# Altium schematic sheet Power_Communications_MCU.SchDoc: MCU, Power, Communications
size B; Date: [Date]; SheetNumber: 1; SheetTotal: 5
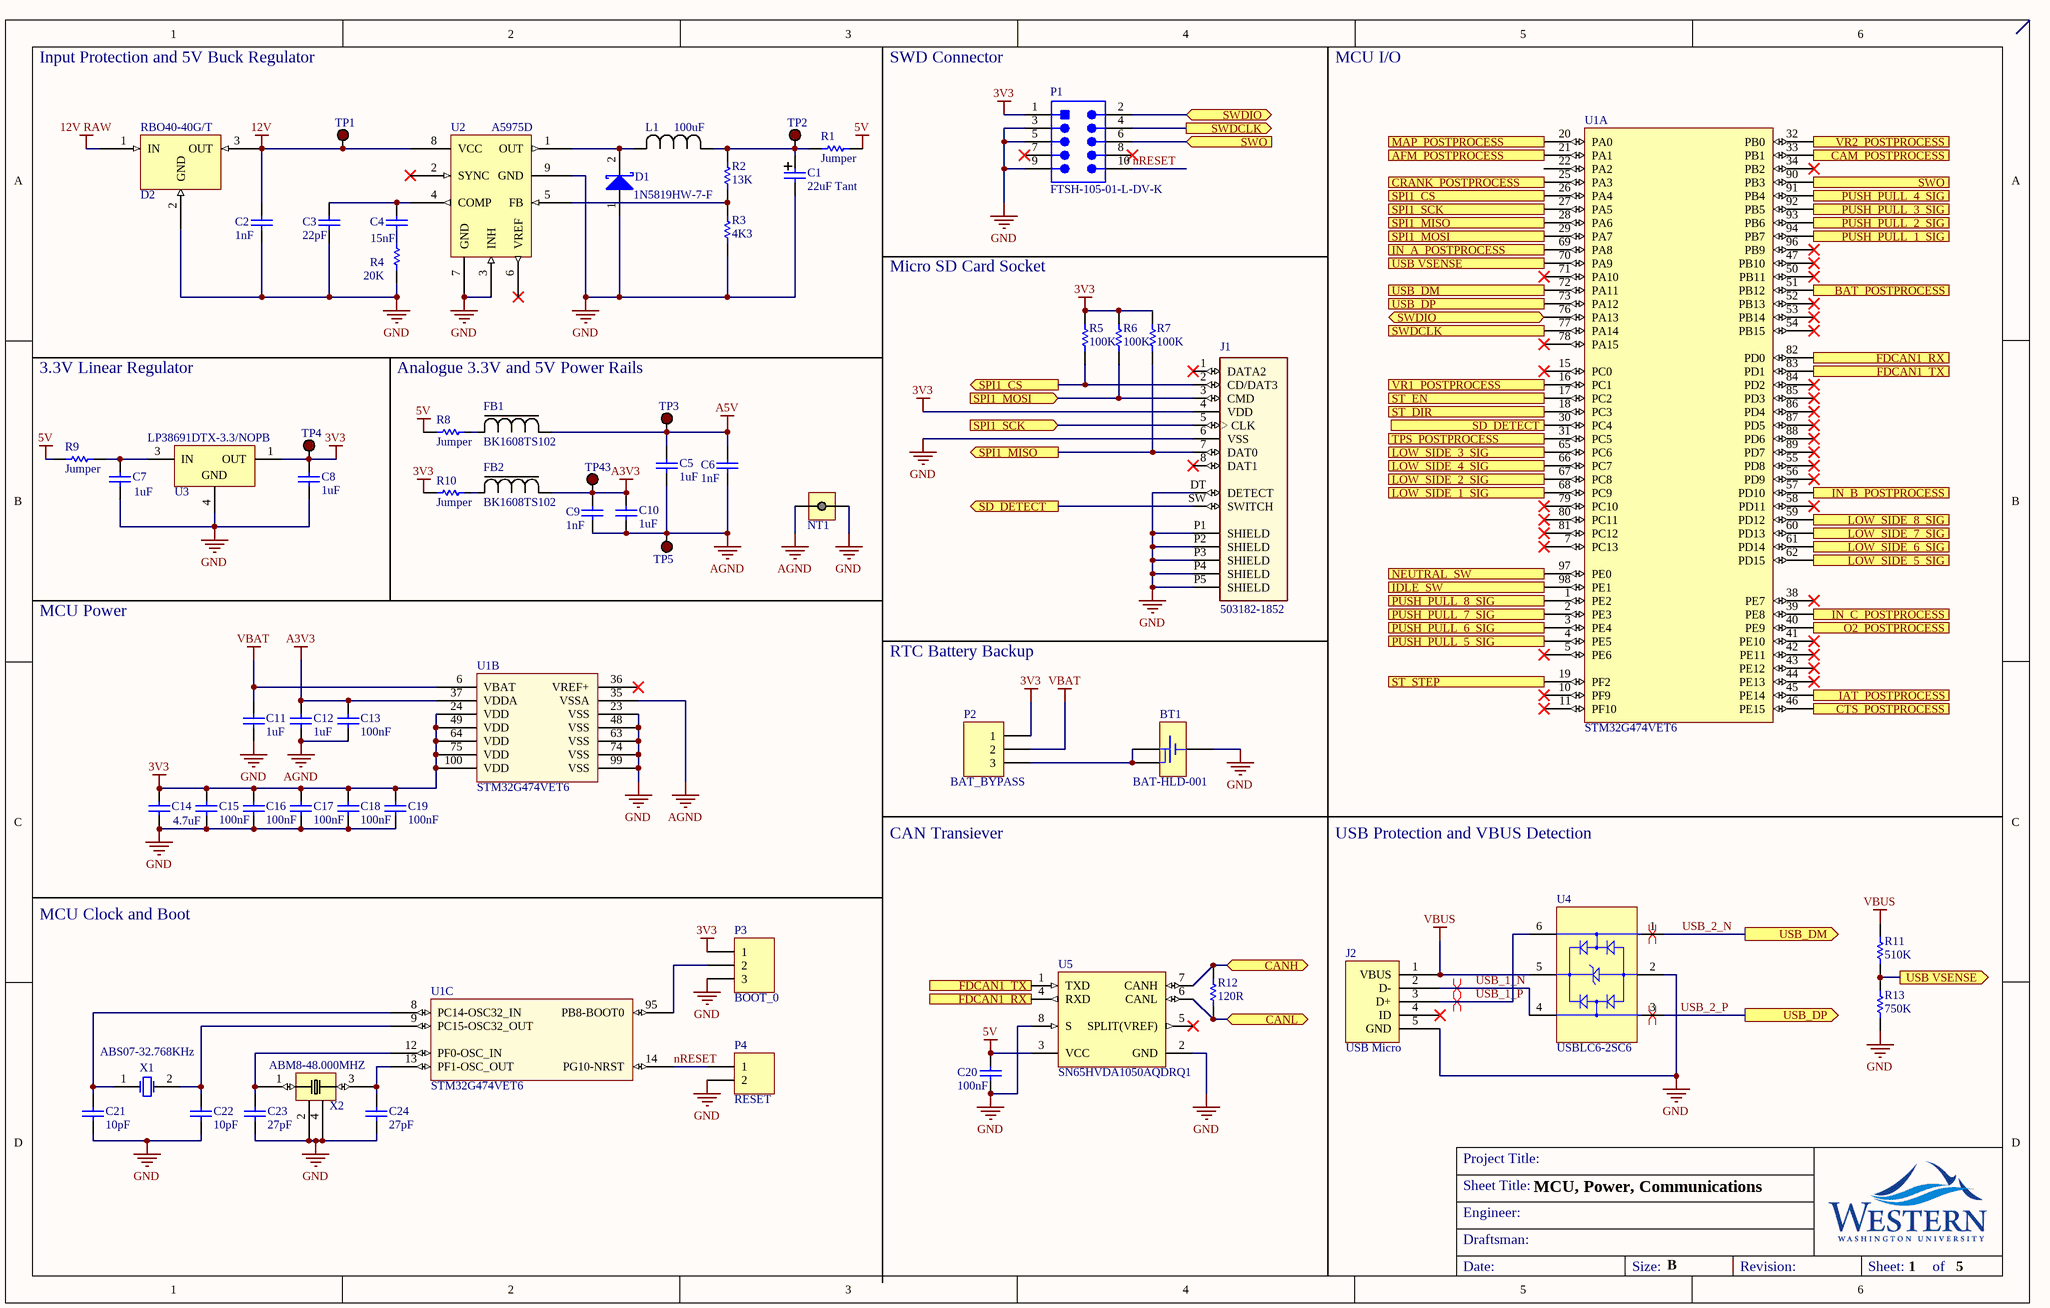
[diagram p0: Power_Communications_MCU.SchDoc]

## Parts
BT1  BAT-HLD-001  [BATHLD-001]
C1  22uF Tant  [CAPC1210(3225)280_L]
C2  1nF  [CAPC0603(1608)100_N]
C3  22pF  [CAPC0603(1608)100_M]
C4  15nF  [CAPC0603(1608)100_M]
C5  1uF  [CAPC0603(1608)100_M]
C6  1nF  [CAPC0603(1608)100_M]
C7  1uF  [CAPC0603(1608)100_M]
C8  1uF  [CAPC0603(1608)100_M]
C9  1nF  [CAPC0603(1608)100_M]
C10  1uF  [CAPC0603(1608)100_M]
C11  1uF  [CAPC0603(1608)100_L]
C12  1uF  [CAPC0603(1608)100_L]
C13  100nF  [CAPC0603(1608)100_L]
C14  4.7uF  [CAPC0603(1608)55_L]
C15  100nF  [CAPC0603(1608)100_L]
C16  100nF  [CAPC0603(1608)100_L]
C17  100nF  [CAPC0603(1608)100_L]
C18  100nF  [CAPC0603(1608)100_L]
C19  100nF  [CAPC0603(1608)100_L]
C20  100nF  [CAPC0603(1608)100_M]
C21  10pF  [CAPC0603(1608)100_L]
C22  10pF  [CAPC0603(1608)100_L]
C23  27pF  [CAPC0603(1608)100_M]
C24  27pF  [CAPC0603(1608)100_M]
D1  1N5819HW-7-F  [DIOD-SOD-123-2_V]
D2  RBO40-40G/T  [D2PAK-L]
FB1  BK1608TS102  [BK1608TS102-T]
FB2  BK1608TS102  [BK1608TS102-T]
J1  503182-1852  [*MOLEX_503182-1852_503182-1852(Primary)]
J2  USB Micro  [USB_CONN]
L1  100uF  [IND_BOURNS_SRR1260-101M]
NT1  NET TIE 0603  [NetTie0603]  (value not drawn)  (net tie, no BOM)
P1  FTSH-105-01-L-DV-K  [SMTC-FTSH-105-01-L-DV-K_V]
P2  BAT_BYPASS  [HDR1X3]
P3  BOOT_0  [HDR1X3]
P4  RESET  [HDR1X2]
R1  Jumper  [RESC0603(1608)_N]
R2  13K  [RESC0603(1608)_M]
R3  4K3  [RESC0603(1608)_M]
R4  20K  [RESC0603(1608)_M]
R5  100K  [RESC0603(1608)_N]
R6  100K  [RESC0603(1608)_N]
R7  100K  [RESC0603(1608)_N]
R8  Jumper  [RESC0603(1608)_N]
R9  Jumper  [RESC0603(1608)_M]
R10  Jumper  [RESC0603(1608)_N]
R11  510K  [RESC0603(1608)_M]
R12  120R  [RESC0603(1608)_L]
R13  750K  [RESC0603(1608)_M]
TP1  5001  [Keystone_5001]  (value not drawn)
TP2  5001  [Keystone_5001]  (value not drawn)
TP3  5001  [Keystone_5001]  (value not drawn)
TP4  5001  [Keystone_5001]  (value not drawn)
TP5  5001  [Keystone_5001]  (value not drawn)
TP43  5001  [Keystone_5001]  (value not drawn)
U1  STM32G474VET6  [STM32G474VET6]  (parts A,B,C of 3)
U2  A5975D  [A5975D_Medium_Density]
U3  LP38691DTX-3.3/NOPB  [TD03B_M]
U4  USBLC6-2SC6  [USBLC6-2SC6]
U5  SN65HVDA1050AQDRQ1  [D8_L]
X1  ABS07-32.768KHz  [ABRA-ABS07-2_V]
X2  ABM8-48.000MHZ  [ABM8-48.000MHZ-10-1-U-T]

## Ports
AFM_POSTPROCESS (in), BAT_POSTPROCESS (in), CAM_POSTPROCESS (in), CANH (bidir), CANL (bidir), CRANK_POSTPROCESS (in), CTS_POSTPROCESS (in), FDCAN1_RX (in), FDCAN1_RX (out), FDCAN1_TX (in), FDCAN1_TX (out), IAT_POSTPROCESS (in), IDLE_SW (out), IN_A_POSTPROCESS (in), IN_B_POSTPROCESS (in), IN_C_POSTPROCESS (in), LOW_SIDE_1_SIG (out), LOW_SIDE_2_SIG (out), LOW_SIDE_3_SIG (out), LOW_SIDE_4_SIG (out), LOW_SIDE_5_SIG (out), LOW_SIDE_6_SIG (out), LOW_SIDE_7_SIG (out), LOW_SIDE_8_SIG (out), MAP_POSTPROCESS (in), NEUTRAL_SW (out), O2_POSTPROCESS (in), PUSH_PULL_1_SIG (out), PUSH_PULL_2_SIG (out), PUSH_PULL_3_SIG (out), PUSH_PULL_4_SIG (out), PUSH_PULL_5_SIG (out), PUSH_PULL_6_SIG (out), PUSH_PULL_7_SIG (out), PUSH_PULL_8_SIG (out), SD_DETECT (in), SD_DETECT (out), SPI1_CS (out), SPI1_MISO (in), SPI1_MISO (out), SPI1_MOSI (in), SPI1_MOSI (out), SPI1_SCK (in), SPI1_SCK (out), ST_DIR (out), ST_EN (out), ST_STEP (out), SWDCLK (in), SWDCLK (out), SWDIO (bidir), SWO (in), SWO (out), TPS_POSTPROCESS (in), USB VSENSE (in), USB VSENSE (out), USB_DM (out), USB_DP (out), VR1_POSTPROCESS (in), VR2_POSTPROCESS (in)

## Nets
3V3: C8.2 C14.2 C15.2 C16.2 C17.2 C18.2 C19.2 J1.4(VDD) P1.1 P2.1 P3.1 R5.2 R6.2 R7.2 R10.1 TP4.1(TP) U1.24(VDD) U1.49(VDD) U1.64(VDD) U1.75(VDD) U1.100(VDD) U3.1(OUT)
5V: C20.2 R1.2 R8.1 R9.1 U5.3(VCC)
12V: C2.1 D2.3(OUT) TP1.1(TP) U2.8(VCC)
12V RAW: D2.1(IN)
A3V3: C9.1 C10.2 C12.2 C13.2 FB2.1 TP43.1(TP) U1.37(VDDA)
A5V: C5.2 C6.1 FB1.1 TP3.1(TP)
AGND: C5.1 C6.2 C9.2 C10.1 C12.1 C13.1 NT1.1 TP5.1(TP) U1.35(VSSA)
GND: BT1.1(-) C1.1 C2.2 C3.1 C7.1 C8.1 C11.1 C14.1 C15.1 C16.1 C17.1 C18.1 C19.1 C20.1 C21.1 C22.1 C23.1 C24.1 D1.1(A) D2.2(GND) J1.6(VSS) J1.DT(DETECT) J1.P1(SHIELD) J1.P2(SHIELD) J1.P3(SHIELD) J1.P4(SHIELD) J1.P5(SHIELD) J2.5(GND) NT1.2 P1.3 P1.5 P1.9 P3.3 P4.2 R3.2 R4.1 R13.1 U1.23(VSS) U1.48(VSS) U1.63(VSS) U1.74(VSS) U1.99(VSS) U2.3(INH) U2.7(GND) U2.9(GND) U3.4(GND) U4.2(GND) U5.2(GND) U5.8(S) X2.2 X2.4
VBAT: C11.2 P2.2 U1.6(VBAT)
VBUS: J2.1(VBUS) R11.2 U4.5(VBUS)
AFM_POSTPROCESS: U1.21(PA1) ; port AFM_POSTPROCESS
BAT_POSTPROCESS: U1.51(PB12) ; port BAT_POSTPROCESS
CAM_POSTPROCESS: U1.33(PB1) ; port CAM_POSTPROCESS
CANH: R12.2 U5.7(CANH) ; port CANH
CANL: R12.1 U5.6(CANL) ; port CANL
CRANK_POSTPROCESS: U1.25(PA3) ; port CRANK_POSTPROCESS
CTS_POSTPROCESS: U1.46(PE15) ; port CTS_POSTPROCESS
FDCAN1_RX: U1.82(PD0) U5.4(RXD) ; port FDCAN1_RX
FDCAN1_TX: U1.83(PD1) U5.1(TXD) ; port FDCAN1_TX
IAT_POSTPROCESS: U1.45(PE14) ; port IAT_POSTPROCESS
IDLE_SW: U1.98(PE1) ; port IDLE_SW
IN_A_POSTPROCESS: U1.69(PA8) ; port IN_A_POSTPROCESS
IN_B_POSTPROCESS: U1.57(PD10) ; port IN_B_POSTPROCESS
IN_C_POSTPROCESS: U1.39(PE8) ; port IN_C_POSTPROCESS
LOW_SIDE_1_SIG: U1.68(PC9) ; port LOW_SIDE_1_SIG
LOW_SIDE_2_SIG: U1.67(PC8) ; port LOW_SIDE_2_SIG
LOW_SIDE_3_SIG: U1.65(PC6) ; port LOW_SIDE_3_SIG
LOW_SIDE_4_SIG: U1.66(PC7) ; port LOW_SIDE_4_SIG
LOW_SIDE_5_SIG: U1.62(PD15) ; port LOW_SIDE_5_SIG
LOW_SIDE_6_SIG: U1.61(PD14) ; port LOW_SIDE_6_SIG
LOW_SIDE_7_SIG: U1.60(PD13) ; port LOW_SIDE_7_SIG
LOW_SIDE_8_SIG: U1.59(PD12) ; port LOW_SIDE_8_SIG
MAP_POSTPROCESS: U1.20(PA0) ; port MAP_POSTPROCESS
NEUTRAL_SW: U1.97(PE0) ; port NEUTRAL_SW
nRESET: P1.10 P4.1 U1.14(PG10-NRST)
O2_POSTPROCESS: U1.40(PE9) ; port O2_POSTPROCESS
PUSH_PULL_1_SIG: U1.94(PB7) ; port PUSH_PULL_1_SIG
PUSH_PULL_2_SIG: U1.93(PB6) ; port PUSH_PULL_2_SIG
PUSH_PULL_3_SIG: U1.92(PB5) ; port PUSH_PULL_3_SIG
PUSH_PULL_4_SIG: U1.91(PB4) ; port PUSH_PULL_4_SIG
PUSH_PULL_5_SIG: U1.4(PE5) ; port PUSH_PULL_5_SIG
PUSH_PULL_6_SIG: U1.3(PE4) ; port PUSH_PULL_6_SIG
PUSH_PULL_7_SIG: U1.2(PE3) ; port PUSH_PULL_7_SIG
PUSH_PULL_8_SIG: U1.1(PE2) ; port PUSH_PULL_8_SIG
SD_DETECT: J1.SW(SWITCH) U1.30(PC4) ; port SD_DETECT
SPI1_CS: J1.2(CD/DAT3) R5.1 U1.26(PA4) ; port SPI1_CS
SPI1_MISO: J1.7(DAT0) R7.1 U1.28(PA6) ; port SPI1_MISO
SPI1_MOSI: J1.3(CMD) R6.1 U1.29(PA7) ; port SPI1_MOSI
SPI1_SCK: J1.5(CLK) U1.27(PA5) ; port SPI1_SCK
ST_DIR: U1.18(PC3) ; port ST_DIR
ST_EN: U1.17(PC2) ; port ST_EN
ST_STEP: U1.19(PF2) ; port ST_STEP
SWDCLK: P1.4 U1.77(PA14) ; port SWDCLK
SWDIO: P1.2 U1.76(PA13) ; port SWDIO
SWO: P1.6 U1.90(PB3) ; port SWO
TPS_POSTPROCESS: U1.31(PC5) ; port TPS_POSTPROCESS
USB VSENSE: R11.1 R13.2 U1.70(PA9) ; port USB VSENSE
USB_1_N: J2.2(D-) U4.4(I/O_3)
USB_1_P: J2.3(D+) U4.6(I/O_4)
USB_2_N: U1.72(PA11) U4.1(I/O_1) ; port USB_DM
USB_2_P: U1.73(PA12) U4.3(I/O_2) ; port USB_DP
VR1_POSTPROCESS: U1.16(PC1) ; port VR1_POSTPROCESS
VR2_POSTPROCESS: U1.32(PB0) ; port VR2_POSTPROCESS
NetBT1_2: BT1.2(+) BT1.3(+) P2.3
NetC1_2: C1.2 L1.1 R1.1 R2.2 TP2.1(TP)
NetC3_2: C3.2 C4.2 U2.4(COMP)
NetC4_1: C4.1 R4.2
NetC7_2: C7.2 R9.2 U3.3(IN)
NetC21_2: C21.2 U1.8(PC14-OSC32_IN) X1.1(X1)
NetC22_2: C22.2 U1.9(PC15-OSC32_OUT) X1.2(X2)
NetC23_2: C23.2 U1.12(PF0-OSC_IN) X2.1
NetC24_2: C24.2 U1.13(PF1-OSC_OUT) X2.3
NetD1_2: D1.2(K) L1.2 U2.1(OUT)
NetFB1_2: FB1.2 R8.2
NetFB2_2: FB2.2 R10.2
NetP3_2: P3.2 U1.95(PB8-BOOT0)
NetR2_1: R2.1 R3.1 U2.5(FB)

Not connected (* = marked no-connect by the designer): J1 1(DATA2)* 8(DAT1)*; J2 4(ID)*; P1 7* 8*; U1 5(PE6)* 7(PC13)* 10(PF9)* 11(PF10)* 15(PC0)* 22(PA2) 34(PB2)* 36(VREF+)* 38(PE7)* 41(PE10)* 42(PE11)* 43(PE12)* 44(PE13)* 47(PB10)* 50(PB11)* 52(PB13)* 53(PB14)* 54(PB15)* 55(PD8)* 56(PD9)* 58(PD11)* 71(PA10)* 78(PA15)* 79(PC10)* 80(PC11)* 81(PC12)* 84(PD2)* 85(PD3)* 86(PD4)* 87(PD5)* 88(PD6)* 89(PD7)* 96(PB9)*; U2 2(SYNC)* 6(VREF)*; U5 5(SPLIT(VREF))*

## Layout directives
differential pair: USB_1_N, USB_1_P, USB_2_N, USB_2_P

## Notes on the sheet
- Input Protection and 5V Buck Regulator
- SWD Connector
- MCU I/O
- Micro SD Card Socket
- 3.3V Linear Regulator
- Analogue 3.3V and 5V Power Rails
- MCU Power
- RTC Battery Backup
- CAN Transiever
- USB Protection and VBUS Detection
- MCU Clock and Boot
- Sheet Title:
- Project Title:
- Engineer:
- Draftsman:
- Date:
- Size:
- B
- Revision:
- Sheet:        of

## Library data of the parts
BT1 = CMP-0168-00043-1: 20mm Coin Cell Battery Holder; PCB_Layout: Complies with manufacturer's recommendation.; DatasheetVersion: rev1.0, Dec-2007; PackageVersion: rev1.0, Dec-2007; PackageReference: BATHLD-001; PackageDescription: Low Profile SM Battery Holder, 20mm Lithium Cell, 21.1 x 15.3 x 4.2 mm Body
C1 = CMP-1038-02268-1: 22uF 10V 1210 (3225 Metric) SMD; Case-Metric: 3225; Case-EIA: 1210; Tolerance: Â±10%; Max Thickness: 2.8 mm; Value: 22uF; Technology: SMT; Rated Voltage: 10 V
C2 = CMP-1035-01887-1: 1nF 50V 0603 (1608 Metric); Case-EIA: 0603; Case-Metric: 1608; Tolerance: Â±2%; Max Thickness: 1 mm; Rated Voltage: 50 V; Value: 1nF; Technology: SMT
C3 = CMP-1035-00822-1: 22pF 50V 0603 (1608 Metric); Case-Metric: 1608; Tolerance: Â±10%; Case-EIA: 0603; Technology: SMT; Max Thickness: 1 mm; Rated Voltage: 50 V; Value: 22pF
C4 = CMP-1035-02380-1: 15nF 50V 0603 (1608 Metric); Case-Metric: 1608; Case-EIA: 0603; Tolerance: Â±5%; Technology: SMT; Max Thickness: 1 mm; Value: 15nF; Rated Voltage: 50 V
C5 C10-C12 = CMP-1035-02733-1: CAP 1uF 10V ±10% 0603 (1608 Metric) Thickness 1mm SMD; Tolerance: Â±10%; Case-EIA: 0603; Case-Metric: 1608; Rated Voltage: 10 V; Max Thickness: 1 mm; Value: 1uF; Technology: SMT
C6 C9 = CMP-1035-01887-1: CAP 1nF 50V ±2% 0603 (1608 Metric) Thickness 1mm SMD; Case-EIA: 0603; Case-Metric: 1608; Tolerance: Â±2%; Max Thickness: 1 mm; Rated Voltage: 50 V; Value: 1nF; Technology: SMT
C7 C8 = CMP-1035-02745-1: CAP 1uF 50V ±10% 0603 (1608 Metric) Thickness 1mm SMD; Case-EIA: 0603; Case-Metric: 1608; Tolerance: Â±10%; Technology: SMT; Value: 1uF; Rated Voltage: 50 V; Max Thickness: 1 mm
C13 C15-C20 = CMP-1035-02580-1: CAP 100nF 10V ±10% 0603 (1608 Metric) Thickness 1mm SMD; Tolerance: Â±10%; Case-EIA: 0603; Case-Metric: 1608; Max Thickness: 1 mm; Value: 100nF; Rated Voltage: 10 V; Technology: SMT
C14 = CMP-1035-02784-1: CAP 4.7uF 10V ±10% 0603 (1608 Metric) Thickness 0.55mm SMD; Case-Metric: 1608; Tolerance: Â±10%; Case-EIA: 0603; Technology: SMT; Max Thickness: 0.55 mm; Value: 4.7uF; Rated Voltage: 10 V
C21 C22 = CMP-1035-00556-1: CAP 10pF 50V ±1% 0603 (1608 Metric) Thickness 1mm SMD; Case-Metric: 1608; Case-EIA: 0603; Tolerance: Â±1%; Technology: SMT; Max Thickness: 1 mm; Rated Voltage: 50 V; Value: 10pF
C23 C24 = CMP-1035-00886-1: CAP 27pF 50V ±1% 0603 (1608 Metric) Thickness 1mm SMD; Case-Metric: 1608; Case-EIA: 0603; Tolerance: Â±1%; Technology: SMT; Max Thickness: 1 mm; Value: 27pF; Rated Voltage: 50 V
D1 = CMP-0303-00003-1: 1.0 A Surface Mount Schottky Barrier Rectifier; Manufacturer: Diodes Inc; @ VR (V): 40; @ Terminal Temperature TT (degC): 90; Maximum Average Rectified Current IO (A): 1; Total Capacitance CT (pF): 50; Peak Forward Surge Current IFSM (A): 25; Forward Voltage Drop VF (V): 0.45; Packing: Tape and Reel; VR (RMS) (V): 28; RoHS: TRUE; PartNumber: 1N5819HW-7-F; ComponentLink2URL: http://www.diodes.com/datasheets/ds30217.pdf; PackageDescription: 2-Pin SOD-123, Body 2.7 x 1.55 mm, Pitch 3.7 mm; @ IF (A): 1; Operating and Storage Temperature Range: -65 to 125 degC; ComponentLink1Description: Manufacturer URL; ComponentLink2Description: Datasheet; ComponentLink1URL: http://www.diodes.com/; Mounting Technology: Surface Mount; DatasheetVersion: Rev. 15-2; PackageReference: SOD-123-2; Maximum Reverse Current IR (uA): 50; Peak Repetitive Reverse Voltage VRRM (V): 40
D2 = RBO40-40G/T: Designed to protect against battery reversal andload dump overvoltages in automotive applica-tions, this monolithic component offers multiplefunctions in the same package.
J1 = 503182-1852: 10 _8 + 2_ Position Card Connector microSDâ„¢ Surface Mount, Right Angle Gold; MF: Molex; MP: 5031821852; Digi-Key_Part_Number: WM12834CT-ND; Digi-Key_Purchase_URL: https://www.digikey.com/product-detail/en/molex/5031821852/WM12834CT-ND/5823232?utm_source=snapeda&utm_medium=aggregator&utm_campaign=symbol; Package: None; SnapEDA_Link: https://www.snapeda.com/parts/5031821852/Molex/view-part/46835/?ref=snap; Value: *
J2 = USB MICRO CONN SMT R/A (Amphenol): Micro USB R/A SMT CONNECTOR; Supplier 1: Digi-Key; Supplier Part Number 1: 609-4618-1-ND
L1 = SRR1260-101M: SRR1260-101M - 100uH; Vendor: Bourns Electronics; Built_By: EMA_UL_Team; Type: DEV; Manufacturer_Part_Number: SRR1260-101M; Copyright: Copyright (C) 2018 Accelerated Designs. All rights reserved; RefDes: RefDes; Value: Value
NT1 = NET TIE
P1 = CMP-2000-05353-1: Male Header, Pitch 1.27 mm, 2 x 5 Position, Height 6.25 mm; Manufacturer: Samtec; Pitch: 0.050"(1.27mm); Other Names: Q3937619; Number of Positions: 10; Mating Products: SFMC-105-L2-S-D-TR-ND / -CONN.05"SURFACE10POSSMT / FLE-105-01-G-DV-TR-ND / -CONNSKT1.27MM10POSDUALSMD / FLE-105-01-G-DV-A-P-ND / -CONNSKT1.27MM10POSDUALSMD / FLE-105-01-G-DV-A-ND / -CONNSKT1.27MM10POSDUALSMD / CLP-105-02-G-D-P-TR-ND / -CONNRCPT10POSDUAL.05"SMD / SAM1155-05-ND / -CONNRCPT10POSDUAL.05"SMD / SAM1154-05-ND / -CONNRCPT10POSDUAL.05"SMD / SAM1153-05-ND / -CONNRCPT10POSDUAL.05"SMD / SAM1226-05-ND / -CONNRCPT.05"10POSDUALSMD; Number of Positions Loaded: All; Connector Type: Header,Unshrouded; Product Training Modules: Board-to-BoardConnectors; Datasheet Version: Rev. ET, 10/1995; Number of Rows: 2; Standard Package: 1; Package Description: Male Header, Pitch 1.27 mm, 2 x 5 Position, Height 5.97 mm, Tail Length 4.32 mm; Contact Finish Thickness: 10µin(0.25µm); Series: FTSH; Termination: Solder; Contact Type: MalePin; Color: Black; Package Reference: FTSH-105-01-L-DV-K; Family: RectangularConnectors-Headers,MalePins; Package URL: http://suddendocs.samtec.com/prints/ftsh-1xx-xx-xxx-dv-xxx-footprint.pdf; Packaging: Tube; Mounting Type: SurfaceMount; Category: Connectors,Interconnects; Datasheet URL: http://suddendocs.samtec.com/prints/ftsh-1xx-xx-xxx-dv-xxx-mkt.pdf; Row Spacing: 0.050"(1.27mm); Manufacturer URL: http://www.samtec.com/; Contact Mating Length: 0.120"(3.05mm); Contact Finish: Gold
P2 P3 = Header 3: Header, 3-Pin; LatestRevisionDate: 17-Jul-2002; LatestRevisionNote: Re-released for DXP Platform.; Publisher: Altium Limited
P4 = Header 2: Header, 2-Pin; LatestRevisionDate: 17-Jul-2002; LatestRevisionNote: Re-released for DXP Platform.; Publisher: Altium Limited
R1 R8-R10 = CMP-1012-00001-1: Jumper 0603 (1608 Metric); Case-Metric: 1608; Value: 0.00 Ohm; Power: None; Case-EIA: 0603; Technology: SMT; Tolerance: None
R2 = CMP-1012-00635-1: 13K 0.1W 1% 0603 (1608 Metric)  SMD; Case-EIA: 0603; Value: 13000.00 Ohm; Case-Metric: 1608; Tolerance: 1 %; Technology: SMT; Power: 0.1 W
R3 = CMP-1012-00581-1: 4K3 0.1W 1% 0603 (1608 Metric)  SMD; Case-Metric: 1608; Value: 4300.00 Ohm; Case-EIA: 0603; Power: 0.1 W; Tolerance: 1 %; Technology: SMT
R4 = CMP-1012-00655-1: 20K 0.1W 1% 0603 (1608 Metric)  SMD; Case-Metric: 1608; Case-EIA: 0603; Value: 20000.00 Ohm; Technology: SMT; Tolerance: 1 %; Power: 0.1 W
R5-R7 = CMP-1012-00736-1: 100K 0.1W 1% 0603 (1608 Metric)  SMD; Value: 100000.00 Ohm; Case-Metric: 1608; Case-EIA: 0603; Power: 0.1 W; Tolerance: 1 %; Technology: SMT
R11 = CMP-1012-00816-1: 510K 0.1W 1% 0603 (1608 Metric)  SMD; Value: 510000.00 Ohm; Case-EIA: 0603; Case-Metric: 1608; Tolerance: 1 %; Technology: SMT; Power: 0.1 W
R12 = CMP-1012-00052-1: 120R 0.1W 5% 0603 (1608 Metric)  SMD; Case-EIA: 0603; Value: 120.00 Ohm; Case-Metric: 1608; Technology: SMT; Power: 0.1 W; Tolerance: 5 %
R13 = CMP-1012-00835-1: 750K 0.1W 1% 0603 (1608 Metric)  SMD; Case-Metric: 1608; Case-EIA: 0603; Value: 750000.00 Ohm; Tolerance: 1 %; Technology: SMT; Power: 0.1 W
TP1-TP5 TP43 = TEST POINT: TEST POINT PC MINI .040"D BLACK; Manufacturer: Keystone Electronics; Supplier 1: Digi-Key; Manufacturer Part Number: 5001; RoHS: RoHS Compliant; Category: Test and Measurement; Stock 1: 7538; Pricing 1: 1=0.34, 10=0.315, 50=0.2296, 100=0.2206, 250=0.19812, 500=0.1891, 1000=0.15759, 2500=0.14408, 5000=0.13508 (USD); Packaging: Bulk; Type: PC Test Point, Miniature; Terminal: 0.010" x 0.020" (0.25mm x 0.51mm) Phosphor Bronze Wire, Silver Plated; Mounting Type: 0.040" (1.02mm) Hole Diameter; Material: Base, Nylon 46, UL 94V-0; Color: Black; ComponentLink1URL: http://www.keyelco.com/product-pdf.cfm?p=1310; ComponentLink1Description: http://www.keyelco.com/product-pdf.cfm?p=1310; Supplier Part Number 1: 5001K-ND
U1 = STM32G474VET6_1
U2 = A5975D: The A5975D is a step-down monolithic power / switching regulator with a minimum switch current / limit of 3.75 A, it is therefore able to deliver up to 3 / A DC current to the load depending on the / application conditions. The output voltage can be / set from 1.235 V to 35 V. The high current level is / also achieved thanks to a HSOP8 package with / exposed frame, that allows to reduce the RTHJ-A / down to approximately 40 °C/W. The device uses / an internal P-channel DMOS transistor (with a / typical RDS(on) of 250 mΩ) as switching element / to minimize the size of the external components. / An internal oscillator fixes the switching frequency / at 250 kHz. Having a minimum input voltage of / only 4 V, it fits automotive applications requiring / device operation even in cold crank conditions. / Pulse-by-pulse current limit with the internal / frequency modulation offers an effective constant / current short-circuit protection.; ComponentLink1Description: STMicro; ComponentLink1URL: https://www.st.com/en/power-management/a5975d.html#resource
U3 = CMP-0062-02610-1: 500mA Low Dropout CMOS Linear Regulators Stable with Ceramic Output Capacitors, 3-pin TO-252, 2500 Reel; Manufacturer: National Semiconductor; High-Reliability: Y; CompType: LDO IC; RoHS: Y; Code_JEDEC: TO-252-AA; ComponentLink3URL: http://www.national.com/pf/LP/LP38691.html; DatasheetVersion: Jun-2011; PackageVersion: revD, Feb-2009; ComponentLink4URL: http://www.national.com/packaging/folders/td03b.html; ComponentLink4Description: TD03B Package Page; PinCount: 3; ComponentLink2Description: LP38691 Datasheet; ComponentLink3Description: LP38691 Web Page; ComponentLink2URL: http://www.national.com/ds/LP/LP38691.pdf; PackageReference: TD03B; ComponentLink1URL: http://www.national.com/; PowerWise: Y; PackageDescription: TO252, Molded, Jedec, 6.8 x 6.10 x 2.30mm Body, 3 Lead, 2.28mm Pitch, Surface Mount; ComponentLink1Description: Manufacturer URL; PartNumber: LP38691DTX-3.3/NOPB
U5 = CMP-0315-00008-1: Automotive Catalog EMC-Optimized High-Speed CAN Transceiver, 70 mA, 5 V, -40 to 125 degC, 8-pin SOIC (D), Green (RoHS & no Sb/Br); Manufacturer: Texas Instruments; Receivers Per Package: 1; Bus Fault Voltage(V): -27 to 40; Supply Voltage(s)(V): 5; ICC(Max)(mA): 70; Transient Pulse Protection(V): -200 to 200; ComponentLink1Description: Datasheet; PackageVersion: revM, Jun-2011; ComponentLink1URL: http://www.ti.com/general/docs/lit/getliterature.tsp?genericPartNumber=SN65HVDA1050A-Q1&fileType=pdf; Mounting Technology: Surface Mount; SubFamily: CAN; Drivers Per Package: 1; Code_JEDEC: MS-012AA; Eco-Plan: Green (RoHS & no Sb/Br); Rating: Automotive; PackageReference: D8; Isolated: No; PartNumber: SN65HVDA1050AQDRQ1; DatasheetVersion: SLLS994A; PackageDescription: 8-Pin Plastic Small Outline Integrated Circuit, 4.9 x 3.9 mm, Pitch 1.27 mm Pitch
X1 = CMP-0447-00001-2: Crystal, 32.768 kHz, 12.5 pF, -40 to 85 degC, SMD Low Profile 3.2 x 1.5 x 0.9 mm, Tape and Reel; Manufacturer: Abracon; PartNumber: ABS07-32.768KHz-T; Q Value (Type): 30000; Operation Mode: Flexural Mode (Tuning Fork); Shunt Capacitance (C0): 0.9 to 1.2 pF; Load Capacitance (CL): 12.5 pF; Frequency Tolerance @+25degC: +/- 20 ppm; Drive Level (Type): 0.1 uW; Equivalent Series Resistance (R1): 70 Kohm; Insulation Resistance (Min): 500 Mohm; ComponentLink3URL: http://www.abracon.com/Resonators/ABS07.pdf; PackageDescription: 2-Pin Hand Drawn, Body 3.2x1.5mm, Pitch 2.5mm; Operating Temperature: -40 to 85 degC; ComponentLink2URL: http://www.abracon.com/Resonators/ABS07.pdf; PackageReference: ABS07-2; ComponentLink3Description: Package Specification; ComponentLink1Description: Manufacturer URL; DatasheetVersion: 04.03.13; Mounting Technology: Surface Mount; ComponentLink2Description: Datasheet; ComponentLink1URL: http://www.abracon.com/; Packing: Tape and Reel; Frequency: 32.768 kHz
X2 = ABM8-48.000MHZ-10-1-U-T